# Altium schematic sheet PAGE1-CONTENT.SchDoc
size A3
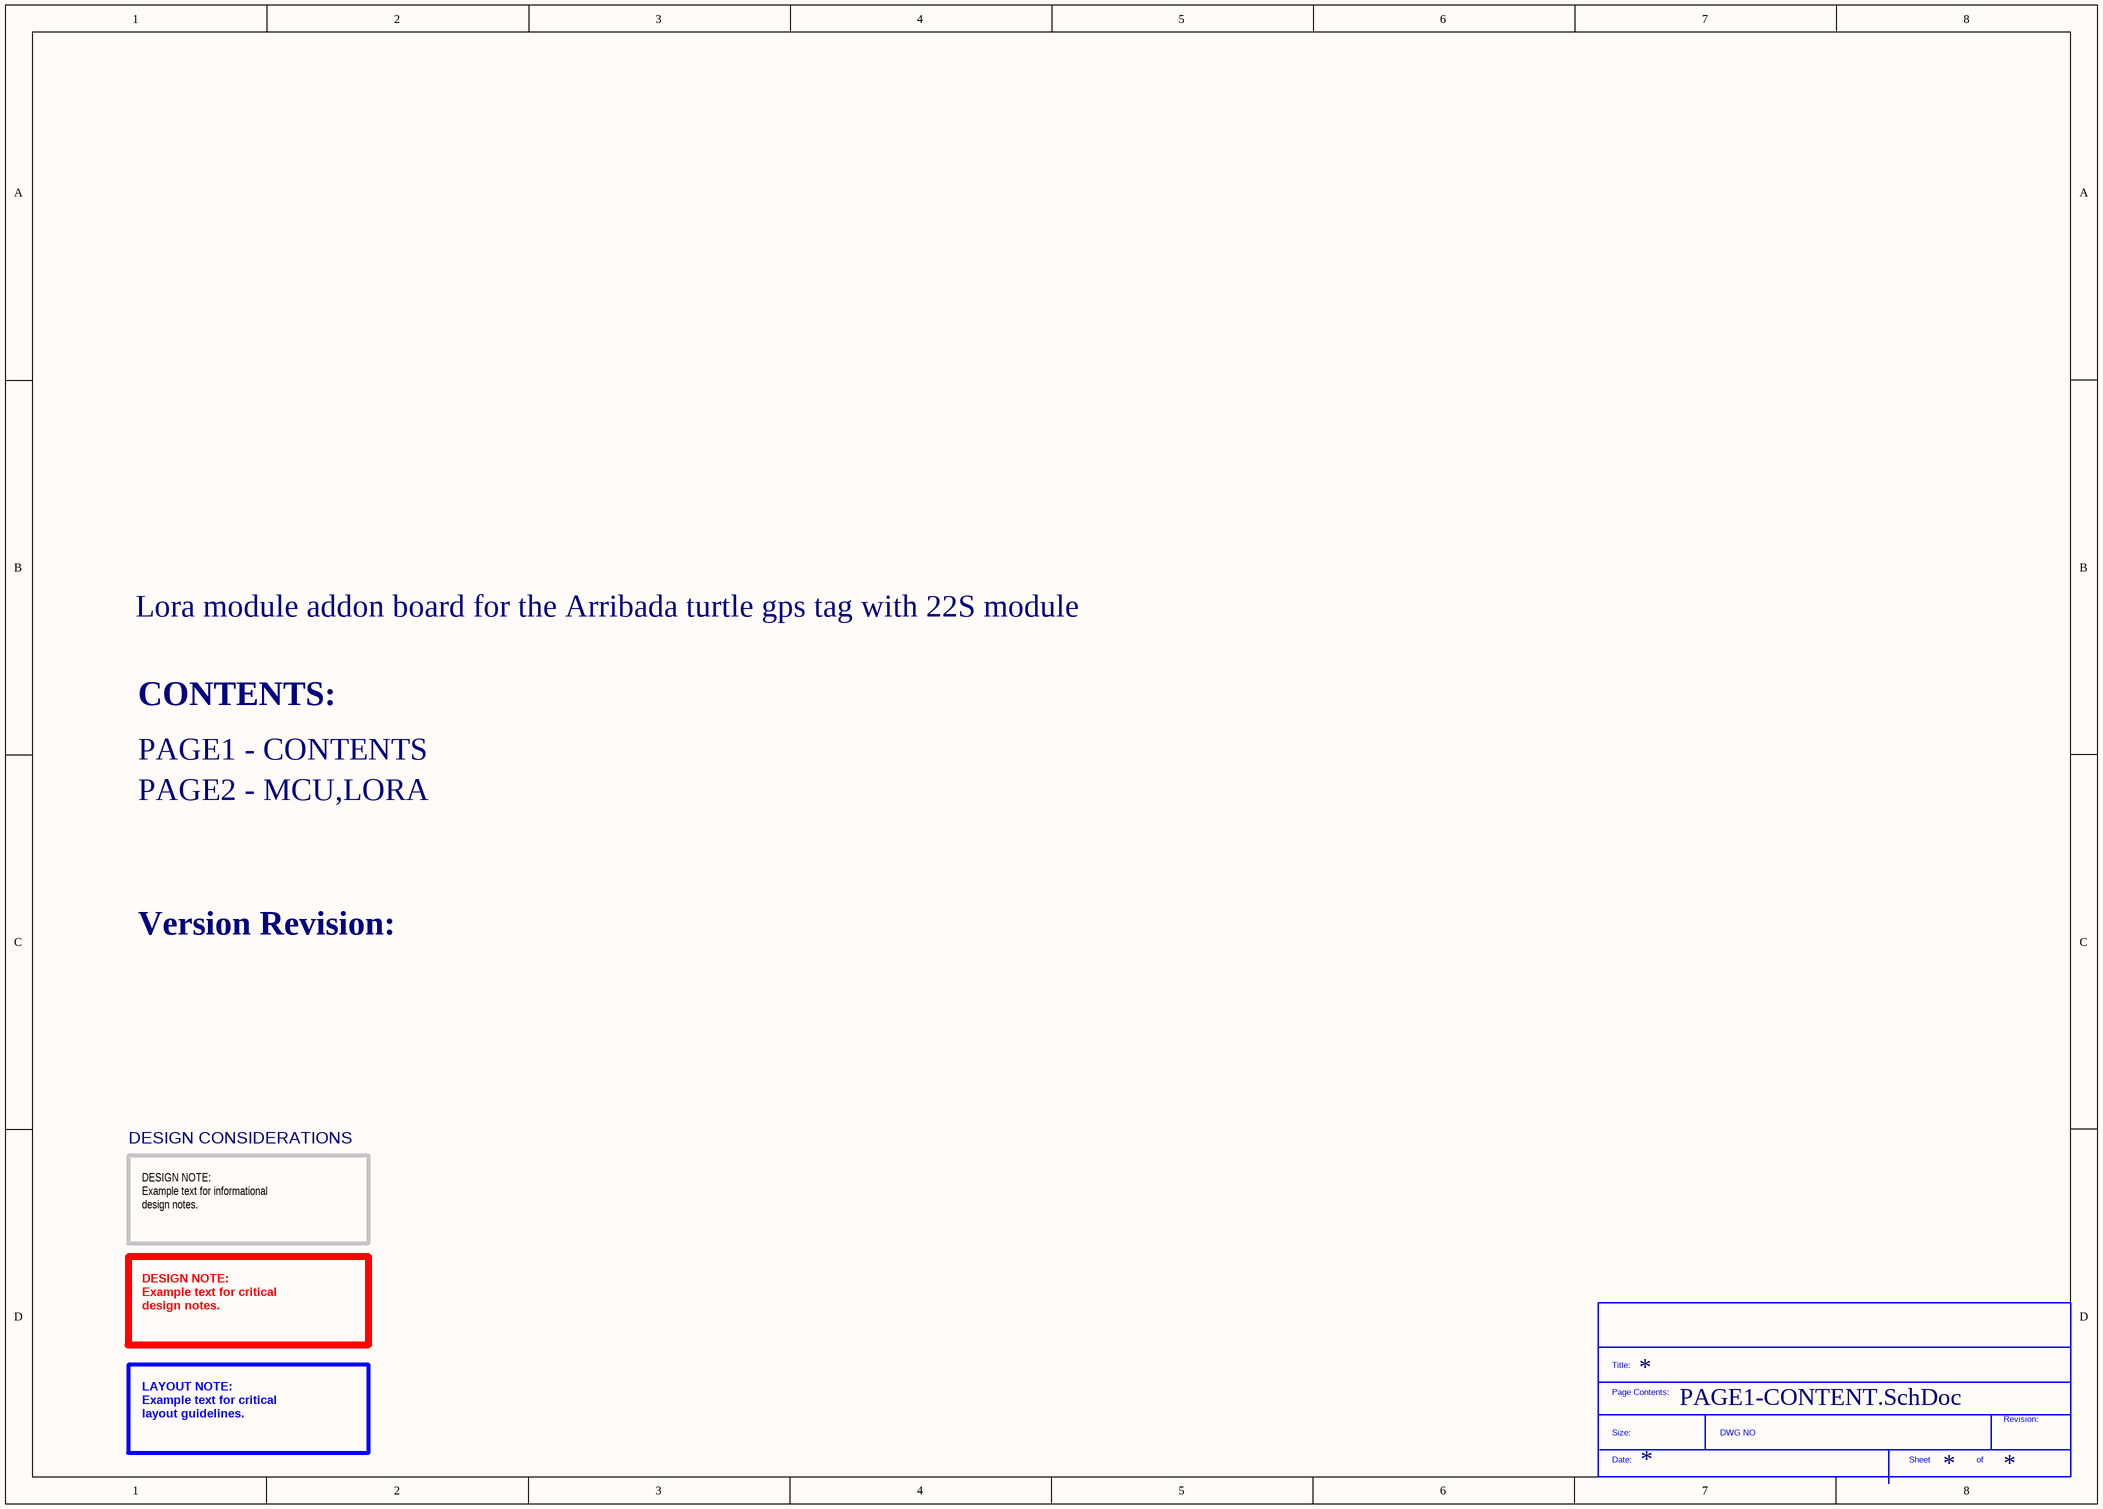
[diagram p0: PAGE1-CONTENT.SchDoc]

## Parts
*?  SDTitleBlock  (value not drawn)  (graphical)

## Notes on the sheet
- Lora module addon board for the Arribada turtle gps tag with 22S module
- CONTENTS:
- PAGE1 - CONTENTS
- PAGE2 - MCU,LORA
- Version Revision:
- DESIGN CONSIDERATIONS
- DESIGN NOTE:
  Example text for informational
  design notes.
- DESIGN NOTE:
  Example text for critical
  design notes.
- LAYOUT NOTE:
  Example text for critical
  layout guidelines.
- (in symbol SDTitleBlock) Title:; Page Contents:; Revision:; Size:; DWG NO; Date:; Sheet; of